# EAGLE design source_eagle (EAGLE 9.6.2)
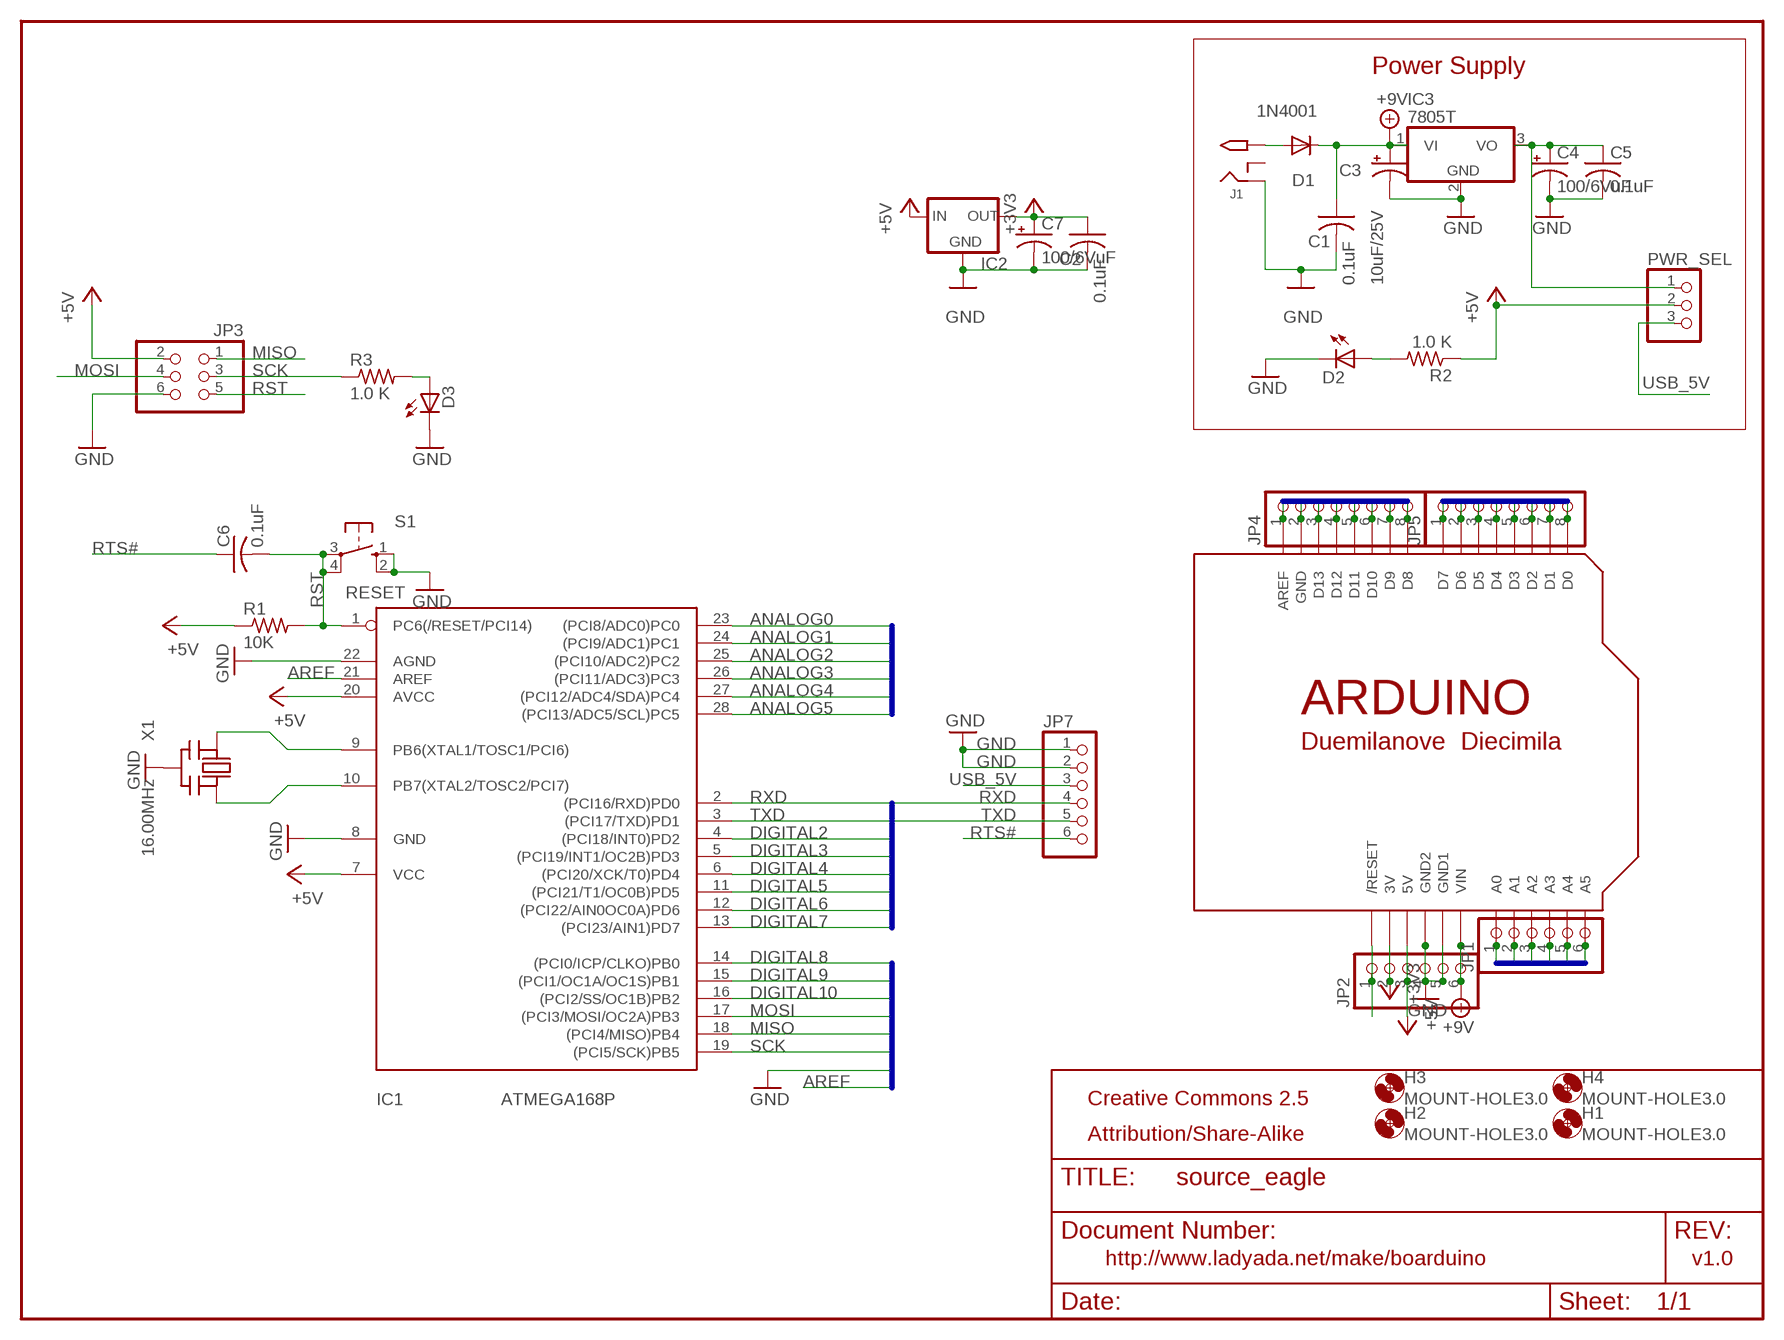
[diagram p0: schematic, sheet 1]

## Parts
C1  0.1uF  C-US025-025X050  [C025-025X050]
C2  0.1uF  C-US025-025X050  [C025-025X050]
C3  10uF/25V  CPOL-USE2.5-6  [E2,5-6]
C4  100/6VuF  CPOL-USE2.5-6  [E2,5-6]
C5  0.1uF  C-US025-025X050  [C025-025X050]
C6  0.1uF  C-US025-025X050  [C025-025X050]
C7  100/6VuF  CPOL-USE2.5-6  [E2,5-6]
D1  1N4001  1N4004  [DO41-10]
D2  LED3MM  [LED3MM]
D3  Green  LED3MM  [LED3MM]
H1  MOUNT-HOLE3.0  [3,0]
H2  MOUNT-HOLE3.0  [3,0]
H3  MOUNT-HOLE3.0  [3,0]
H4  MOUNT-HOLE3.0  [3,0]
IC1  ATMEGA168P  ATMEGA168PROUND  [DIL28/3]
IC2  MCP1700INLINE  [TO92-INLINE]
IC3  7805T  [TO220H]
J1  2.1MMJACK  [PJ-102A]
JP1  PINHD-1X6CB  [1X06-CLEANBIG]
JP2  PINHD-1X6CB  [1X06-CLEANBIG]
JP3  PINHD-2X3  [2X03]
JP4  PINHD-1X8CLEANBIG  [1X08-CLEANBIG]
JP5  PINHD-1X8CLEANBIG  [1X08-CLEANBIG]
JP7  PINHD-1X6CLEAN  [1X06-CLEAN]
PWR_SEL  PINHD-1X3  [1X03]
R1  10K  R-US_0207/10  [0207/10]
R2  1.0 K  R-US_0207/10  [0207/10]
R3  1.0 K  R-US_0207/10  [0207/10]
S1  RESET  10-XX  [B3F-10XX]
U$2  ARDUINO-NOHOLE  [ARDUINO-NOHOLE]
X1  16.00MHz  CERMOSCILL  [CERM_OSC]

## Nets
+3V3: C2.1 C7.+ IC2.3(OUT) JP2.2 U$2.3V
+5V: IC1.7(VCC) IC1.20(AVCC) IC2.2(IN) JP2.3 JP3.2 PWR_SEL.2 R1.1 R2.1 U$2.5V
+9V: C1.1 C3.+ D1.C IC3.1(VI) JP2.6 U$2.VIN
ANALOG0: IC1.23((PCI8/ADC0)PC0) JP1.1 U$2.A0
ANALOG1: IC1.24((PCI9/ADC1)PC1) JP1.2 U$2.A1
ANALOG2: IC1.25((PCI10/ADC2)PC2) JP1.3 U$2.A2
ANALOG3: IC1.26((PCI11/ADC3)PC3) JP1.4 U$2.A3
ANALOG4: IC1.27((PCI12/ADC4/SDA)PC4) JP1.5 U$2.A4
ANALOG5: IC1.28((PCI13/ADC5/SCL)PC5) JP1.6 U$2.A5
AREF: IC1.21(AREF) JP4.1 U$2.AREF
DIGITAL2: IC1.4((PCI18/INT0)PD2) JP5.6 U$2.D2
DIGITAL3: IC1.5((PCI19/INT1/OC2B)PD3) JP5.5 U$2.D3
DIGITAL4: IC1.6((PCI20/XCK/T0)PD4) JP5.4 U$2.D4
DIGITAL5: IC1.11((PCI21/T1/OC0B)PD5) JP5.3 U$2.D5
DIGITAL6: IC1.12((PCI22/AIN0OC0A)PD6) JP5.2 U$2.D6
DIGITAL7: IC1.13((PCI23/AIN1)PD7) JP5.1 U$2.D7
DIGITAL8: IC1.14((PCI0/ICP/CLKO)PB0) JP4.8 U$2.D8
DIGITAL9: IC1.15((PCI1/OC1A/OC1S)PB1) JP4.7 U$2.D9
DIGITAL10: IC1.16((PCI2/SS/OC1B)PB2) JP4.6 U$2.D10
GND: C1.2 C2.2 C3.- C4.- C5.2 C7.- D2.K(C) D3.K(C) IC1.8(GND) IC1.22(AGND) IC2.1(GND) IC3.2(GND) J1.RING JP2.4 JP2.5 JP3.6 JP4.2 JP7.1 JP7.2 S1.1(S) S1.2(S1) U$2.GND U$2.GND1 U$2.GND2 X1.P$2(GND)
MISO: IC1.18((PCI4/MISO)PB4) JP3.1 JP4.4 U$2.D12
MOSI: IC1.17((PCI3/MOSI/OC2A)PB3) JP3.4 JP4.5 U$2.D11
N$1: IC1.9(PB6(XTAL1/TOSC1/PCI6)) X1.P$1(IN)
N$2: IC1.10(PB7(XTAL2/TOSC2/PCI7)) X1.P$3(OUT)
N$3: D2.A R2.2
N$4: D3.A R3.2
N$5: C4.+ C5.1 IC3.3(VO) PWR_SEL.1
N$17: D1.A J1.TIP
RST: C6.2 IC1.1(PC6(/RESET/PCI14)) JP2.1 JP3.5 R1.2 S1.3(P) S1.4(P1) U$2.RESET(/RESET)
RTS#: C6.1 JP7.6
RXD: IC1.2((PCI16/RXD)PD0) JP5.8 JP7.4 U$2.D0
SCK: IC1.19((PCI5/SCK)PB5) JP3.3 JP4.3 R3.1 U$2.D13
TXD: IC1.3((PCI17/TXD)PD1) JP5.7 JP7.5 U$2.D1
USB_5V: JP7.3 PWR_SEL.3
Unconnected: J1.RING_SW

## Buses
ANALOG[0..5]
RXD,TXD,DIGITAL[2..7]
DIGITAL[8..10],MOSI,MISO,SCK,GND,AREF

## Notes on the sheet
- Power Supply
- Creative Commons 2.5
- Attribution/Share-Alike
- http://www.ladyada.net/make/boarduino | v1.0

## Library data of the parts
C1 C2 C5 C6 = minimidi:C-US: CAPACITOR, American symbol
C3 C4 C7 = minimidi:CPOL-US: POLARIZED CAPACITOR, American symbol
D1 = minimidi:1N4004: DIODE general purpose rectifier, 1 A
D2 D3 = adafruit:LED: LED OSRAM: - CHIPLED LG R971, LG N971, LY N971, LG Q971, LY Q971, LO R971, LY R971 LH N974, LH R974 LS Q976, LO Q976, LY Q976 LO Q996 - Hyper CHIPLED LW Q18S LB Q993, LB Q99A, LB R99A - SideLED LS A670, LO A670, LY A670, LG A670, LP A670 LB A673, LV A673, LT A673, LW A673 LH A674 LY A675 LS A676, LA A676, LO A676, LY A676, LW A676 LS A679, LY A679, LG A679 - Hyper Micro SIDELED® LS Y876, LA Y876, LO Y876, LY Y876 LT Y87S - SmartLED LW L88C, LW L88S LB L89C, LB L89S, LG L890 LS L89K, LO L89K, LY L89K LS L896, LA L896, LO L896, LY L896 - TOPLED LS T670, LO T670, LY T670, LG T670, LP T670 LSG T670, LSP T670, LSY T670, LOP T670, LYG T670 LG T671, LOG T671, LSG T671 LB T673, LV T673, LT T673, LW T673 LH T674 LS T676, LA T676, LO T676, LY T676, LB T676, LH T676, LSB T676, LW T676 LB T67C, LV T67C, LT T67C, LS T67K, LO T67K, LY T67K, LW E67C LS E67B, LA E67B, LO E67B, LY E67B, LB E67C, LV E67C, LT E67C LW T67C LS T679, LY T679, LG T679 LS T770, LO T770, LY T770, LG T770, LP T770 LB T773, LV T773, LT T773, LW T773 LH T774 LS E675, LA E675, LY E675, LS T675 LS T776, LA T776, LO T776, LY T776, LB T776 LHGB T686 LT T68C, LB T68C - Hyper Mini TOPLED® LB M676 - Mini TOPLED Santana® LG M470 LS M47K, LO M47K, LY M47K Source: http://www.osram.convergy.de/
H1-H4 = holes:MOUNT-HOLE: MOUNTING HOLE with drill center marker
IC1 = avr:ATMEGA168*P: MICROCONTROLLER 16 kBytes FLASH 1 kBytes SRAM 512 Bytes EEPROM USART 8-channel 10 bit ADC
IC2 = adafruit:MCP1700: VOLTAGE REGULATOR
IC3 = adafruit:78*: Positive VOLTAGE REGULATOR Added bigger pads to the TO-92 package
J1 = minimidi:2.1MMJACK
JP1 JP2 = adafruit:PINHD-1X6: PIN HEADER
JP3 = pinhead-ez:PINHD-2X3: PIN HEADER
JP4 JP5 = adafruit:PINHD-1X8: PIN HEADER
JP7 = carduino:PINHD-1X6: PIN HEADER
PWR_SEL = pinhead:PINHD-1X3: PIN HEADER
R1-R3 = adafruit:R-US_: RESISTOR, American symbol
S1 = switch-omron:10-XX: OMRON SWITCH
U$2 = adafruit:ARDUINO: Arduino Diecimila/Duemilanove Make a shield with ease, this package has all the named pins as well as the two mounting drill holes and an outline of the USB and DC power connector. The outline is on the DIMENSION layer, so if your board house uses it they will cut the outline to match. http://www.ladyada.net/library/pcb/eaglelibrary.html
X1 = digg:CERMOSCILL

## Board
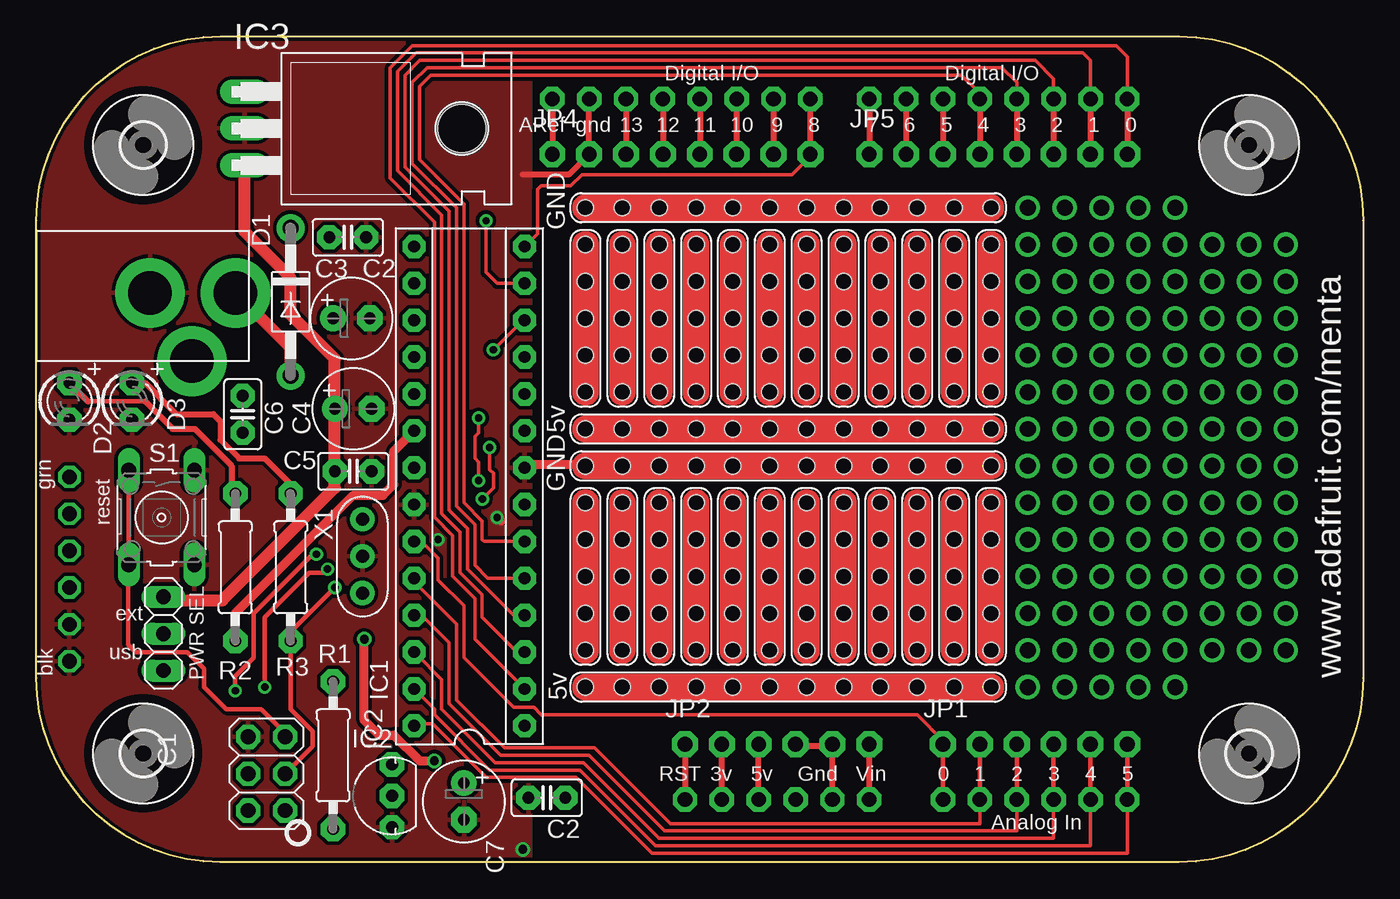
[diagram p1: board, top side]
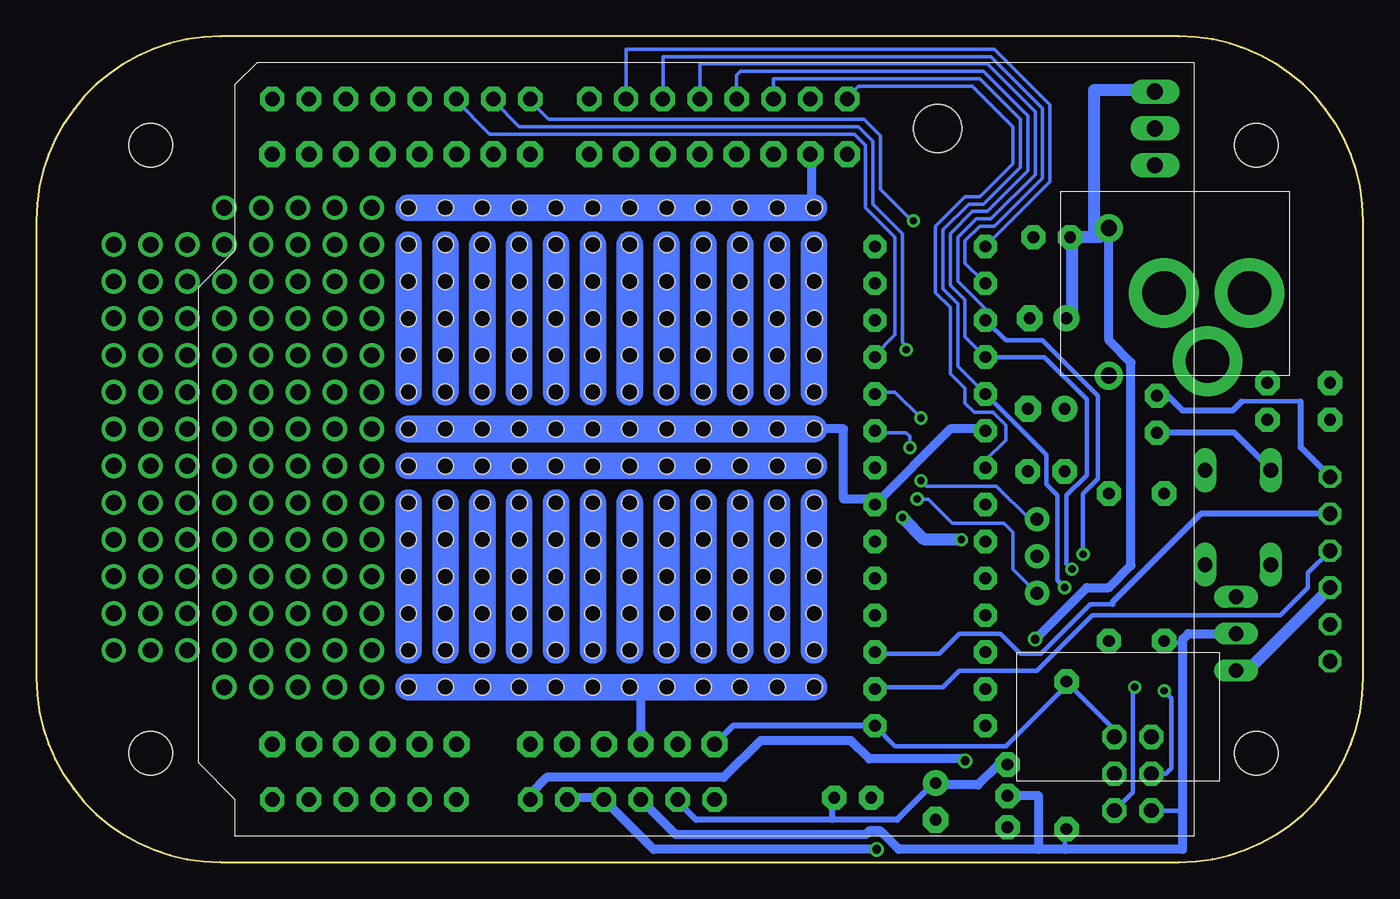
[diagram p2: board, bottom side, seen from below]

Size 91.44 x 56.9 mm. Coordinates in mm from the lower left corner, seen from the top.
Copper layers (1*16): Top 0.035mm / dielectric 1.5mm / Bottom 0.035mm
Design rules "default": minimum track width 10mil, minimum drill 19mil, track to track 10mil, track to pad 10mil, pad to pad 10mil, via to via 10mil, smd to smd 0mil, copper to edge 10mil, drill to drill 8mil, minimum pad ring 10mil, minimum via ring 8mil, stop-mask expansion 4mil, vias tented up to drill 0mil, thermal gap 10mil

### Footprints (pad centres in the part's own frame; a part is rotated, then mirrored left to right if it is on the bottom)
C025-025X050 = drill 0.813 pad 1.676 octagon: 1 -1.27,0; 2 1.27,0
E2,5-6 = drill 0.813 pad 1.778: + -1.27,0 | drill 0.813 pad 1.778 octagon: - 1.27,0
DO41-10 = drill 1.118 pad 1.93: A 5.08,0; C -5.08,0
LED3MM = drill 0.813 pad 1.676 octagon: A -1.27,0; K 1.27,0
3,0 = hole 3: 0,0
DIL28/3 = drill 0.813 pad 1.6 octagon: 1 -16.51,-3.81; 2 -13.97,-3.81; 3 -11.43,-3.81; 4 -8.89,-3.81; 5 -6.35,-3.81; 6 -3.81,-3.81; 7 -1.27,-3.81; 8 1.27,-3.81; 9 3.81,-3.81; 10 6.35,-3.81; 11 8.89,-3.81; 12 11.43,-3.81; 13 13.97,-3.81; 14 16.51,-3.81; 15 16.51,3.81; 16 13.97,3.81; 17 11.43,3.81; 18 8.89,3.81; 19 6.35,3.81; 20 3.81,3.81; 21 1.27,3.81; 22 -1.27,3.81; 23 -3.81,3.81; 24 -6.35,3.81; 25 -8.89,3.81; 26 -11.43,3.81; 27 -13.97,3.81; 28 -16.51,3.81
TO92-INLINE = drill 0.813 pad 1.676 octagon: 1 -2.159,0; 2 0,0; 3 2.159,0
TO220H = drill 1.118 long: 1 -2.54,-10.16; 2 0,-10.16; 3 2.54,-10.16 | hole 3.302: 0,4.826
PJ-102A = drill 3 pad 4.8: RING 0.1,-3.39; RING_SW -4.6,-6.29; TIP 0.1,-9.29
1X06-CLEANBIG = drill 1.016 pad 1.778 octagon: 1 -6.35,0; 2 -3.81,0; 3 -1.27,0; 4 1.27,0; 5 3.81,0; 6 6.35,0
2X03 = drill 1.016 pad 1.676 octagon: 1 -2.54,-1.27; 2 -2.54,1.27; 3 0,-1.27; 4 0,1.27; 5 2.54,-1.27; 6 2.54,1.27
1X08-CLEANBIG = drill 1.016 pad 1.778 octagon: 1 -8.89,0; 2 -6.35,0; 3 -3.81,0; 4 -1.27,0; 5 1.27,0; 6 3.81,0; 7 6.35,0; 8 8.89,0
1X06-CLEAN = drill 1.016 octagon: 1 -6.35,0; 2 -3.81,0; 3 -1.27,0; 4 1.27,0; 5 3.81,0; 6 6.35,0
1X03 = drill 1.016 long: 1 -2.54,0; 2 0,0; 3 2.54,0
0207/10 = drill 0.813 pad 1.676 octagon: 1 -5.08,0; 2 5.08,0
B3F-10XX = drill 1.016 long: 1 -3.251,2.261; 2 3.251,2.261; 3 -3.251,-2.261; 4 3.251,-2.261
ARDUINO-NOHOLE = drill 1 pad 1.676 octagon: 3V 35.56,2.54; 5V 38.1,2.54; A0 50.8,2.54; A1 53.34,2.54; A2 55.88,2.54; A3 58.42,2.54; A4 60.96,2.54; A5 63.5,2.54; AREF 23.876,50.8; D0 63.5,50.8; D1 60.96,50.8; D2 58.42,50.8; D3 55.88,50.8; D4 53.34,50.8; D5 50.8,50.8; D6 48.26,50.8; D7 45.72,50.8; D8 41.656,50.8; D9 39.116,50.8; D10 36.576,50.8; D11 34.036,50.8; D12 31.496,50.8; D13 28.956,50.8; GND 26.416,50.8; GND1 43.18,2.54; GND2 40.64,2.54; RESET 33.02,2.54; VIN 45.72,2.54
12-STRIP = hole 1.1: -13.97,0; -1.27,0; 13.97,0; -3.81,0; 1.27,0; -6.35,0; 3.81,0; 6.35,0; -11.43,0; -8.89,0; 8.89,0; 11.43,0
5-STRIP = hole 1.1: -5.08,0; 0,0; 5.08,0; -2.54,0; 2.54,0
CERM_OSC = drill 0.9 pad 1.676: P$1 -2.54,0; P$2 0,0; P$3 2.54,0

### Placement (x,y rotation side)
C1  21.46,43.05 0 top
C2  35.18,4.45 180 top
C3  21.72,37.47 0 top
C4  21.84,31.24 0 top
C5  21.84,26.92 0 top
C6  14.22,30.86 270 top
C7  29.46,4.19 270 top
D1  17.53,38.61 270 top
D2  2.29,31.75 270 top
D3  6.6,31.75 270 top
H1  83.57,7.49 0 top
H2  83.57,49.4 0 top
H3  7.37,7.49 0 top
H4  7.37,49.4 0 top
IC1  29.84,25.91 90 top
IC2  24.51,4.57 90 top
IC3  24.51,50.55 270 top
J1  4.45,39.12 90 top
JP1  68.83,8.13 0 top
JP2  51.05,8.13 0 top
JP3  15.88,6.1 90 top
JP4  44.45,48.77 0 top
JP5  66.29,48.77 0 top
JP7  2.29,20.19 90 top
PWR_SEL  8.76,15.75 270 top
R1  20.45,7.37 90 top
R2  13.72,20.32 90 top
R3  17.53,20.32 90 top
S1  8.64,23.75 270 top
U$2  11.68,1.78 0 top
U$3  [12-STRIP]  51.82,29.84 0 top
U$4  [12-STRIP]  51.82,27.3 0 top
U$5  [12-STRIP]  51.82,45.09 0 top
U$6  [12-STRIP]  51.82,12.06 0 top
U$7  [5-STRIP]  37.85,37.47 90 top
U$8  [5-STRIP]  40.39,37.47 90 top
U$9  [5-STRIP]  42.93,37.47 90 top
U$10  [5-STRIP]  45.47,37.47 90 top
U$11  [5-STRIP]  48.01,37.47 90 top
U$12  [5-STRIP]  50.55,37.47 90 top
U$13  [5-STRIP]  53.09,37.47 90 top
U$14  [5-STRIP]  55.63,37.47 90 top
U$15  [5-STRIP]  58.17,37.47 90 top
U$16  [5-STRIP]  60.71,37.47 90 top
U$17  [5-STRIP]  63.25,37.47 90 top
U$18  [5-STRIP]  65.79,37.47 90 top
U$19  [5-STRIP]  37.85,19.68 90 top
U$20  [5-STRIP]  40.39,19.68 90 top
U$21  [5-STRIP]  42.93,19.68 90 top
U$22  [5-STRIP]  45.47,19.68 90 top
U$23  [5-STRIP]  48.01,19.68 90 top
U$24  [5-STRIP]  50.55,19.68 90 top
U$25  [5-STRIP]  53.09,19.68 90 top
U$26  [5-STRIP]  55.63,19.68 90 top
U$27  [5-STRIP]  58.17,19.68 90 top
U$28  [5-STRIP]  60.71,19.68 90 top
U$29  [5-STRIP]  63.25,19.68 90 top
U$30  [5-STRIP]  65.79,19.68 90 top
U$31  [ALTOIDSTIN-DIM]  45.72,28.45 0 bottom
X1  22.48,21.08 90 top

### Tracks (layer width: path | path; a pad name or v marks a point on that pad's centre or on a via)
+3V3
  Top 0.406: JP2.2 U$2.3V 47.37,4.32
  Bottom 0.406: U$2.3V 47.24,4.19 45.97,2.92 36.58,2.92 | C7.+ 29.59,5.46 32.13,2.92 36.58,2.92 | C2.1 36.58,4.45 36.58,2.92
  Bottom 0.61: IC2.3 25.15,6.73 26.54,5.33 29.46,5.33 C7.+
+5V
  Top 0.406: U$2.5V JP2.3
  Top 0.61: IC1.20 24.64,28.32 24.64,26.04 23.88,25.27 21.84,25.27 13.72,17.14 R2.1
  Bottom 0.305: JP3.2 12.45,3.56 12.45,3.68 | R1.1 20.57,2.16 20.57,0.89 | R2.1 13.59,15.11 12.45,15.11
  Bottom 0.61: U$2.5V 47.37,1.91 34.29,1.91 34.04,2.16 33.27,2.16 32,0.89 22.35,0.89 | 22.35,0.89 20.57,0.89 12.45,0.89 12.45,3.68 12.45,15.11 12.45,15.37 12.06,15.75 PWR_SEL.2 | IC1.7 33.78,24.77 | IC1.20 26.16,29.84 28.45,29.84 IC1.7 | IC2.2 22.35,4.57 22.35,0.89 | 37.85,29.84 35.81,29.84 35.81,25.02 33.66,25.02 IC1.7
+9V  (via drill 0.6)
  Top 0.406: U$2.VIN JP2.6
  Top 0.61: v22.61,15.37 22.61,9.78 23.62,8.76 24.64,8.76 26.42,6.99 v27.43,6.99
  Bottom 0.61: U$2.VIN 57.4,4.7 56.26,5.84 44.07,5.84 41.53,8.38 35.31,8.38 34.04,7.11 27.43,7.11 v27.43,6.99 | v22.61,15.37 19.05,18.92 17.53,18.92 16,20.45 16,34.42 17.53,35.94 D1.C
  Bottom 0.813: D1.C 18.16,43.05 | 18.16,43.05 20.07,43.05 | 20.07,43.05 C1.1 | C3.+ 20.07,37.85 20.07,43.05 | 18.16,43.05 18.54,43.43 18.54,53.21 14.22,53.21 IC3.1
ANALOG0
  Top 0.254: IC1.23 26.16,21.97 26.67,21.97 27.69,20.95 27.69,19.43 29.46,17.65 29.46,14.1 32.89,10.67 34.29,10.67 34.8,10.16 60.71,10.16 62.48,8.38 JP1.1
  Top 0.305: JP1.1 U$2.A0
ANALOG1
  Top 0.254: U$2.A1 65.02,2.67 43.69,2.67 38.48,7.87 32.26,7.87 28.96,11.18 28.96,16.38 26.16,19.18 26.16,19.68 IC1.24
  Top 0.305: JP1.2 64.9,8 65.02,7.87 U$2.A1
  Bottom 0.254: IC1.24 25.91,19.68
ANALOG2
  Top 0.254: U$2.A2 67.56,2.16 43.31,2.16 38.1,7.37 32,7.37 28.45,10.92 28.45,15.11 26.42,17.14 26.29,17.02 IC1.25
  Top 0.305: JP1.3 67.82,7.87 67.56,7.62 U$2.A2
ANALOG3
  Top 0.254: U$2.A3 70.1,1.65 42.93,1.65 37.72,6.86 31.62,6.86 27.94,10.54 27.94,12.57 26.16,14.35 26.16,14.61 IC1.26
  Top 0.305: JP1.4 70.1,8 70.23,7.87 70.1,7.75 U$2.A3
ANALOG4
  Top 0.254: U$2.A4 72.64,1.14 42.67,1.14 37.47,6.35 31.24,6.35 27.43,10.16 27.43,10.54 IC1.27
  Top 0.305: U$2.A4 JP1.5
ANALOG5
  Top 0.254: U$2.A5 75.18,0.64 42.42,0.64 37.21,5.84 30.99,5.84 27.3,9.53 26.16,9.53 IC1.28
  Top 0.305: U$2.A5 JP1.6
  Bottom 0.254: IC1.28 25.91,9.53
AREF
  Top 0.406: 35.56,52.7 U$2.AREF JP4.1
  Bottom 0.254: U$2.AREF 35.56,52.7 34.8,53.47 26.92,53.47 24.13,50.67 24.13,48.13 26.42,45.85 27.43,45.85 29.46,43.81 29.46,39.24 28.45,38.23 28.45,33.66 27.43,32.64 27.43,31.62 26.8,30.99 25.53,30.99 24.64,30.1 24.64,29.08 26.04,27.69 IC1.21
DIGITAL2
  Top 0.254: IC1.4 32.89,17.02 29.72,20.19 29.72,22.99 28.45,24.26 28.45,44.83 25.4,47.88 25.4,54.23 26.42,55.24 68.83,55.24 70.1,53.98 U$2.D2
  Top 0.406: U$2.D2 JP5.6
DIGITAL3
  Top 0.254: IC1.5 31.11,19.56 30.23,20.45 30.23,23.24 28.96,24.51 28.96,45.09 25.91,48.13 25.91,53.72 26.92,54.74 66.55,54.74 67.56,53.72 67.56,52.7 67.44,52.58 | 67.44,52.58 67.31,52.45 | 67.44,52.58 U$2.D3
  Top 0.406: U$2.D3 JP5.5
DIGITAL4
  Top 0.254: IC1.6 30.86,22.1 30.73,22.23 30.73,23.5 29.46,24.77 29.46,45.34 26.42,48.39 26.42,53.47 27.18,54.23 63.75,54.23 65.02,52.96 U$2.D4
  Top 0.406: JP5.4 U$2.D4 64.9,52.58
DIGITAL5
  Top 0.406: U$2.D5 JP5.3
  Bottom 0.254: U$2.D5 62.61,52.7 62.61,52.58 60.2,50.16 35.05,50.16 34.29,49.4 34.29,45.09 32.26,43.05 32.26,36.32 33.66,34.92 IC1.11
DIGITAL6  (via drill 0.5)
  Top 0.254: IC1.12 33.53,37.47 33.53,37.59 33.78,37.59 v31.5,35.31
  Top 0.406: U$2.D6 59.94,52.45 | 59.94,52.45 JP5.2 | 59.94,52.45 60.07,52.45
  Bottom 0.254: U$2.D6 59.94,52.45 58.17,50.67 34.8,50.67 33.78,49.66 33.78,45.34 31.75,43.31 31.75,35.81 31.5,35.56 v31.5,35.31
DIGITAL7  (via drill 0.5)
  Top 0.254: 33.78,39.88 IC1.13 31.75,39.88 30.99,40.64 v30.99,44.2
  Top 0.406: U$2.D7 JP5.1
  Bottom 0.254: 57.4,52.7 U$2.D7 57.4,52.45 56.13,51.18 34.42,51.18 33.27,50.04 33.27,46.35 30.99,44.07 v30.99,44.2
DIGITAL8
  Top 0.254: IC1.14 34.54,43.31 34.54,46.35 34.8,46.61 36.83,46.61 37.59,47.37 52.07,47.37 53.34,48.64 JP4.8 | 53.47,52.45 53.59,52.45 | 53.47,52.45 U$2.D8 | 53.09,52.45 53.34,52.45 53.47,52.45
  Top 0.406: U$2.D8 53.34,52.45 JP4.8
DIGITAL9
  Top 0.406: 50.8,52.7 U$2.D9 JP4.7
  Bottom 0.254: U$2.D9 50.8,56.01 25.4,56.01 21.59,52.2 21.59,46.86 IC1.15
DIGITAL10
  Top 0.406: U$2.D10 JP4.6
  Bottom 0.254: U$2.D10 48.26,55.5 25.65,55.5 22.1,51.94 22.1,47.12 25.4,43.81 26.42,43.81 27.43,42.8 27.43,41.27 26.16,40.01 25.91,40.01 IC1.16
GND  (via drill 0.5, 0.6)
  Top 0.254: IC1.22 26.04,24.13
  Top 0.406: U$2.GND1 54.86,8 | 54.86,8 JP2.5 | JP2.4 52.45,8 54.86,8 | U$2.GND JP4.2 36.7,47.37 33.53,47.37
  Top 0.61: v31.75,23.75 32,23.5 | IC1.8 33.78,27.3 34.04,27.3 arc-90 34.16,27.43 37.97,27.43 37.97,27.05
  Bottom 0.61: 52.2,4.45 52.07,4.45 | 52.2,4.45 U$2.GND2 48.9,0.89 v33.53,0.89 | U$2.GND1 54.74,4.45 52.2,4.45 | 38.1,45.21 37.97,45.34 37.97,48.9 38.1,49.02 JP4.2
  Bottom 0.813: v27.69,22.23 30.23,22.23 v31.75,23.75
  pour Top: -0.25,57.28 -0.25,-0.13 34.04,-0.13 34.04,57.28
MISO  (via drill 0.5)
  Top 0.305: v15.75,12.06 15.75,16.89 18.8,19.94 19.81,19.94 v20.07,20.19
  Top 0.406: U$2.D12 JP4.4
  Bottom 0.254: IC1.18 27.43,36.2 27.43,38.73 28.45,39.75 28.45,43.31 26.92,44.83 25.91,44.83 23.11,47.62 23.11,51.44 26.16,54.48 42.93,54.48 43.18,54.23 U$2.D12 43.18,52.45
  Bottom 0.305: JP3.1 15.88,4.83 15.88,12.06 v15.75,12.06 | IC1.18 21.97,34.8 19.05,31.88 19.05,26.67 20.45,25.27 20.45,20.57 v20.07,20.19
MOSI  (via drill 0.5)
  Top 0.305: v13.72,11.81 13.72,12.83 14.99,14.1 14.99,17.14 19.05,21.21 v19.3,21.21
  Top 0.406: U$2.D11 JP4.5
  Bottom 0.254: U$2.D11 45.72,54.99 25.91,54.99 22.61,51.69 22.61,47.37 25.65,44.32 26.67,44.32 27.94,43.05 27.94,40.01 25.91,37.97 25.91,37.21 IC1.17
  Bottom 0.305: JP3.4 13.59,6.1 13.21,6.48 13.21,11.3 v13.72,11.81 | 25.91,37.21 24.64,35.94 22.1,35.94 18.29,32.13 18.29,26.42 19.3,25.4 v19.3,21.21
N$1  (via drill 0.5)
  Top 0.254: v30.73,25.02 31.5,25.78 31.5,26.8 31.24,27.05 v31.24,28.57
  Bottom 0.254: X1.P$1 24.13,20.19 24.13,22.73 24.77,23.37 28.32,23.37 29.97,25.02 v30.73,25.02 | IC1.9 33.78,29.59 31.5,29.59 31.24,29.34 v31.24,28.57
N$2  (via drill 0.5)
  Top 0.254: v30.48,26.29 30.48,27.56 30.23,27.81 30.23,29.34 30.48,29.59 v30.48,30.61
  Bottom 0.254: X1.P$3 22.99,23.62 25.27,25.91 30.1,25.91 v30.48,26.29 | IC1.10 33.4,32.26 33.27,32.38 32.26,32.38 v30.48,30.61
N$3
  Top 0.305: 3.56,31.75 7.49,31.75
  Top 0.406: D2.A 3.56,31.75 | 7.49,31.75 9.4,29.84 10.92,29.84 13.46,27.3 13.46,25.53 13.59,25.53 R2.2
N$4
  Top 0.406: D3.A 7.49,33.02 9.65,30.86 12.19,30.86 12.7,30.35 12.7,29.08 13.97,27.81 15.75,27.81 18.03,25.53 17.91,25.4 R3.2
N$5
  Top 0.813: IC3.3 14.35,43.43 17.53,40.26 17.53,37.72 20.57,34.67 C4.+ C5.1 20.57,25.78 12.83,18.03 8.89,18.03 8.89,18.16 PWR_SEL.1
N$6
  Bottom 0.61: 49.78,8.26 49.78,11.3
N$7  (via drill 1.1 pad 1.68)
  other vias: 68.33,32.38
N$8  (via drill 1.1 pad 1.68)
  other vias: 68.33,34.92
N$9  (via drill 1.1 pad 1.68)
  other vias: 68.33,37.47
N$10  (via drill 1.1 pad 1.68)
  other vias: 68.33,40.01
N$11  (via drill 1.1 pad 1.68)
  other vias: 68.33,42.55
N$12  (via drill 1.1 pad 1.68)
  other vias: 68.33,45.09
N$13  (via drill 1.1 pad 1.68)
  other vias: 70.87,45.09
N$14  (via drill 1.1 pad 1.68)
  other vias: 70.87,42.55
N$15  (via drill 1.1 pad 1.68)
  other vias: 73.41,42.55
N$16  (via drill 1.1 pad 1.68)
  other vias: 73.41,45.09
N$17
  Top 0.813: J1.TIP 17.53,35.42 D1.A
  Bottom 0.813: D1.A 17.53,33.27
N$18  (via drill 1.1 pad 1.68)
  other vias: 75.95,45.09
N$19  (via drill 1.1 pad 1.68)
  other vias: 75.95,42.55
N$20  (via drill 1.1 pad 1.68)
  other vias: 78.49,42.55
N$21  (via drill 1.1 pad 1.68)
  other vias: 78.49,45.09
N$23  (via drill 1.1 pad 1.68)
  other vias: 81.03,42.55
N$24  (via drill 1.1 pad 1.68)
  other vias: 83.57,42.55
N$25  (via drill 1.1 pad 1.68)
  other vias: 86.11,42.55
N$26  (via drill 1.1 pad 1.68)
  other vias: 86.11,40.01
N$27  (via drill 1.1 pad 1.68)
  other vias: 83.57,40.01
N$28  (via drill 1.1 pad 1.68)
  other vias: 81.03,40.01
N$29  (via drill 1.1 pad 1.68)
  other vias: 78.49,40.01
N$30  (via drill 1.1 pad 1.68)
  other vias: 75.95,40.01
N$31  (via drill 1.1 pad 1.68)
  other vias: 73.41,40.01
N$32  (via drill 1.1 pad 1.68)
  other vias: 70.87,40.01
N$33  (via drill 1.1 pad 1.68)
  other vias: 70.87,37.47
N$34  (via drill 1.1 pad 1.68)
  other vias: 75.95,37.47
N$35  (via drill 1.1 pad 1.68)
  other vias: 73.41,37.47
N$36  (via drill 1.1 pad 1.68)
  other vias: 70.87,34.92
N$37  (via drill 1.1 pad 1.68)
  other vias: 70.87,32.38
N$38  (via drill 1.1 pad 1.68)
  other vias: 75.95,32.38
N$39  (via drill 1.1 pad 1.68)
  other vias: 73.41,34.92
N$40  (via drill 1.1 pad 1.68)
  other vias: 75.95,34.92
N$41  (via drill 1.1 pad 1.68)
  other vias: 73.41,32.38
N$42  (via drill 1.1 pad 1.68)
  other vias: 78.49,32.38
N$43  (via drill 1.1 pad 1.68)
  other vias: 78.49,34.92
N$44  (via drill 1.1 pad 1.68)
  other vias: 78.49,37.47
N$45  (via drill 1.1 pad 1.68)
  other vias: 83.57,37.47
N$46  (via drill 1.1 pad 1.68)
  other vias: 81.03,34.92
N$47  (via drill 1.1 pad 1.68)
  other vias: 81.03,37.47
N$48  (via drill 1.1 pad 1.68)
  other vias: 83.57,34.92
N$49  (via drill 1.1 pad 1.68)
  other vias: 81.03,32.38
N$50  (via drill 1.1 pad 1.68)
  other vias: 83.57,32.38
N$51  (via drill 1.1 pad 1.68)
  other vias: 86.11,32.38
N$52  (via drill 1.1 pad 1.68)
  other vias: 86.11,34.92
N$53  (via drill 1.1 pad 1.68)
  other vias: 86.11,37.47
N$54  (via drill 1.1 pad 1.68)
  other vias: 86.11,29.84
N$55  (via drill 1.1 pad 1.68)
  other vias: 83.57,29.84
N$56  (via drill 1.1 pad 1.68)
  other vias: 81.03,29.84
N$57  (via drill 1.1 pad 1.68)
  other vias: 75.95,29.84
N$58  (via drill 1.1 pad 1.68)
  other vias: 78.49,29.84
N$59  (via drill 1.1 pad 1.68)
  other vias: 73.41,29.84
N$60  (via drill 1.1 pad 1.68)
  other vias: 70.87,29.84
N$61  (via drill 1.1 pad 1.68)
  other vias: 68.33,29.84
N$62  (via drill 1.1 pad 1.68)
  other vias: 68.33,27.3
N$63  (via drill 1.1 pad 1.68)
  other vias: 73.41,27.3
N$64  (via drill 1.1 pad 1.68)
  other vias: 70.87,27.3
N$65  (via drill 1.1 pad 1.68)
  other vias: 78.49,27.3
N$66  (via drill 1.1 pad 1.68)
  other vias: 75.95,27.3
N$67  (via drill 1.1 pad 1.68)
  other vias: 81.03,27.3
N$68  (via drill 1.1 pad 1.68)
  other vias: 86.11,27.3
N$69  (via drill 1.1 pad 1.68)
  other vias: 83.57,27.3
N$70  (via drill 1.1 pad 1.68)
  other vias: 83.57,24.77
N$71  (via drill 1.1 pad 1.68)
  other vias: 81.03,24.77
N$72  (via drill 1.1 pad 1.68)
  other vias: 86.11,24.77
N$73  (via drill 1.1 pad 1.68)
  other vias: 86.11,22.23
N$74  (via drill 1.1 pad 1.68)
  other vias: 83.57,22.23
N$75  (via drill 1.1 pad 1.68)
  other vias: 81.03,22.23
N$76  (via drill 1.1 pad 1.68)
  other vias: 78.49,22.23
N$77  (via drill 1.1 pad 1.68)
  other vias: 78.49,24.77
N$78  (via drill 1.1 pad 1.68)
  other vias: 68.33,24.77
N$79  (via drill 1.1 pad 1.68)
  other vias: 68.33,22.23
N$80  (via drill 1.1 pad 1.68)
  other vias: 68.33,19.68
N$81  (via drill 1.1 pad 1.68)
  other vias: 68.33,17.14
N$82  (via drill 1.1 pad 1.68)
  other vias: 68.33,14.61
N$83  (via drill 1.1 pad 1.68)
  other vias: 68.33,12.06
N$84  (via drill 1.1 pad 1.68)
  other vias: 70.87,12.06
N$85  (via drill 1.1 pad 1.68)
  other vias: 70.87,14.61
N$86  (via drill 1.1 pad 1.68)
  other vias: 70.87,17.14
N$87  (via drill 1.1 pad 1.68)
  other vias: 73.41,19.68
N$88  (via drill 1.1 pad 1.68)
  other vias: 70.87,19.68
N$89  (via drill 1.1 pad 1.68)
  other vias: 70.87,22.23
N$90  (via drill 1.1 pad 1.68)
  other vias: 70.87,24.77
N$91  (via drill 1.1 pad 1.68)
  other vias: 75.95,24.77
N$92  (via drill 1.1 pad 1.68)
  other vias: 73.41,22.23
N$93  (via drill 1.1 pad 1.68)
  other vias: 73.41,24.77
N$94  (via drill 1.1 pad 1.68)
  other vias: 75.95,22.23
N$95  (via drill 1.1 pad 1.68)
  other vias: 75.95,19.68
N$96  (via drill 1.1 pad 1.68)
  other vias: 73.41,17.14
N$97  (via drill 1.1 pad 1.68)
  other vias: 73.41,14.61
N$98  (via drill 1.1 pad 1.68)
  other vias: 73.41,12.06
N$99  (via drill 1.1 pad 1.68)
  other vias: 75.95,12.06
N$100  (via drill 1.1 pad 1.68)
  other vias: 75.95,14.61
N$101  (via drill 1.1 pad 1.68)
  other vias: 75.95,17.14
N$102  (via drill 1.1 pad 1.68)
  other vias: 78.49,19.68
N$103  (via drill 1.1 pad 1.68)
  other vias: 78.49,17.14
N$104  (via drill 1.1 pad 1.68)
  other vias: 78.49,14.61
N$105  (via drill 1.1 pad 1.68)
  other vias: 81.03,14.61
N$107  (via drill 1.1 pad 1.68)
  other vias: 83.57,14.61
N$108  (via drill 1.1 pad 1.68)
  other vias: 83.57,17.14
N$109  (via drill 1.1 pad 1.68)
  other vias: 81.03,17.14
N$110  (via drill 1.1 pad 1.68)
  other vias: 81.03,19.68
N$111  (via drill 1.1 pad 1.68)
  other vias: 83.57,19.68
N$112  (via drill 1.1 pad 1.68)
  other vias: 86.11,19.68
N$113  (via drill 1.1 pad 1.68)
  other vias: 86.11,17.14
N$114  (via drill 1.1 pad 1.68)
  other vias: 86.11,14.61
N$115  (via drill 1.1 pad 1.68)
  other vias: 78.49,12.06
RST
  Top 0.305: 6.38,25.78 S1.3 | 6.38,25.78 S1.4 6.38,20.55 6.35,20.57 6.35,14.99 6.86,14.48 10.41,14.48 11.56,13.34 11.56,12.06 13.08,10.54 15.49,10.54 17.27,8.76 JP3.5 17.02,8.76 16.76,8.76 | 6.38,25.78 6.35,25.78
  Top 0.406: 44.7,8.26 JP2.1 U$2.RESET
  Bottom 0.305: JP3.5 17.27,8.51 17.27,9.27 R1.2 20.57,12.32 20.57,12.06 24.64,8 32.26,8 IC1.1 | JP2.1 44.83,8.13
  Bottom 0.406: S1.3 6.38,27.03 6.35,27.05 8.89,29.59 C6.2 | IC1.1 43.43,9.4 JP2.1
RTS#
  Bottom 0.305: 4.32,31.75 8.38,31.75
  Bottom 0.406: JP7.6 4.32,28.57 4.32,31.75 | 8.38,31.75 9.02,31.11 12.45,31.11 13.46,32.13 C6.1
RXD
  Top 0.254: IC1.2 30.23,15.37 30.23,18.16 28.7,19.68 28.7,22.48 27.43,23.75 27.43,44.07 24.38,47.12 24.38,54.74 25.91,56.26 74.42,56.26 75.18,55.5 U$2.D0
  Top 0.406: U$2.D0 75.18,52.7 | 75.18,52.7 JP5.8 | 75.18,52.7 75.06,52.7
  Bottom 0.305: JP7.4 3.81,19.94 3.81,18.92 5.71,17.02 18.67,17.02 22.48,13.21 27.81,13.21 28.96,12.06 33.78,12.06 IC1.2
SCK  (via drill 0.5)
  Top 0.305: JP3.3 19.05,8 19.05,9.02 17.53,10.54 R3.1 17.53,15.88 v20.57,18.92
  Top 0.406: 40.64,52.7 U$2.D13 JP4.3
  Bottom 0.254: IC1.19 27.94,34.16 27.94,38.48 28.96,39.5 28.96,43.56 27.18,45.34 26.16,45.34 23.62,47.88 23.62,51.18 26.42,53.98 40.64,53.98 U$2.D13 40.64,52.45
  Bottom 0.305: IC1.19 21.84,28.07 21.84,26.04 21.08,25.27 21.08,19.43 v20.57,18.92
TXD
  Top 0.254: IC1.3 33.15,14.48 30.73,16.89 30.73,18.41 29.21,19.94 29.21,22.73 27.94,24 27.94,44.58 24.89,47.62 24.89,54.48 26.16,55.75 72.14,55.75 72.64,55.24 U$2.D1
  Top 0.406: U$2.D1 72.64,52.45 | 72.64,52.45 JP5.7 | 72.64,52.45 72.52,52.45
  Bottom 0.305: IC1.3 33.53,14.35 29.21,14.35 27.81,15.75 25.02,15.75 23.62,14.35 22.23,14.35 18.8,17.78 17.27,17.78
  Bottom 0.406: 17.27,17.78 17.27,17.91 11.18,24 JP7.5
USB_5V
  Bottom 0.813: JP7.3 8,13.21 PWR_SEL.3

### Text on the board
tPlace: GND | D1 | C2 | C3 | C6 | C4 | D2 | D3 | 5v | S1 | C5 | grn | reset | GND | X1 | PWR SEL | ext | usb | R1 | R2 | R3 | IC1 | blk | www.adafruit.com/menta | 5v | IC2 | C1